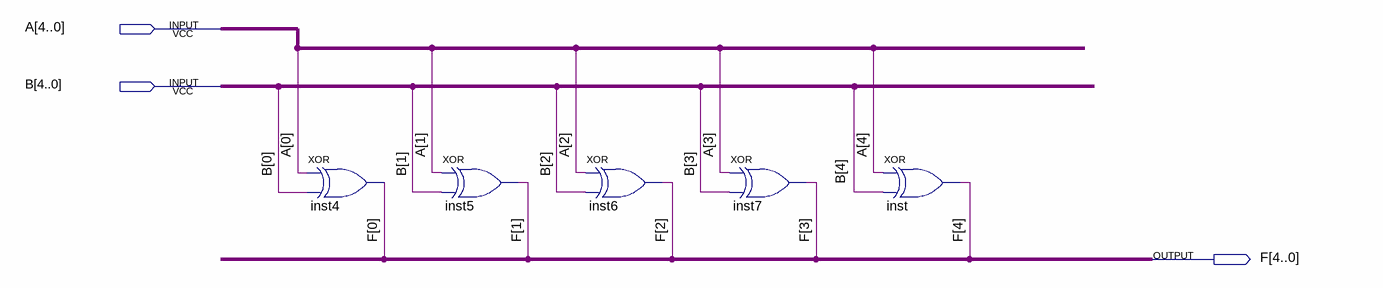
[diagram p0: schematic sheet]
// Quartus schematic XorOK.bdf as structural Verilog: 5 symbols, 3 pins
module XorOK (
  input  [4:0] A,
  input  [4:0] B,
  output [4:0] F
);

  xor inst4 (F[0], A[0], B[0]);
  xor inst5 (F[1], A[1], B[1]);
  xor inst6 (F[2], A[2], B[2]);
  xor inst7 (F[3], A[3], B[3]);
  xor inst (F[4], A[4], B[4]);
endmodule
